# EAGLE schematic Benjamino (EAGLE 6.1)
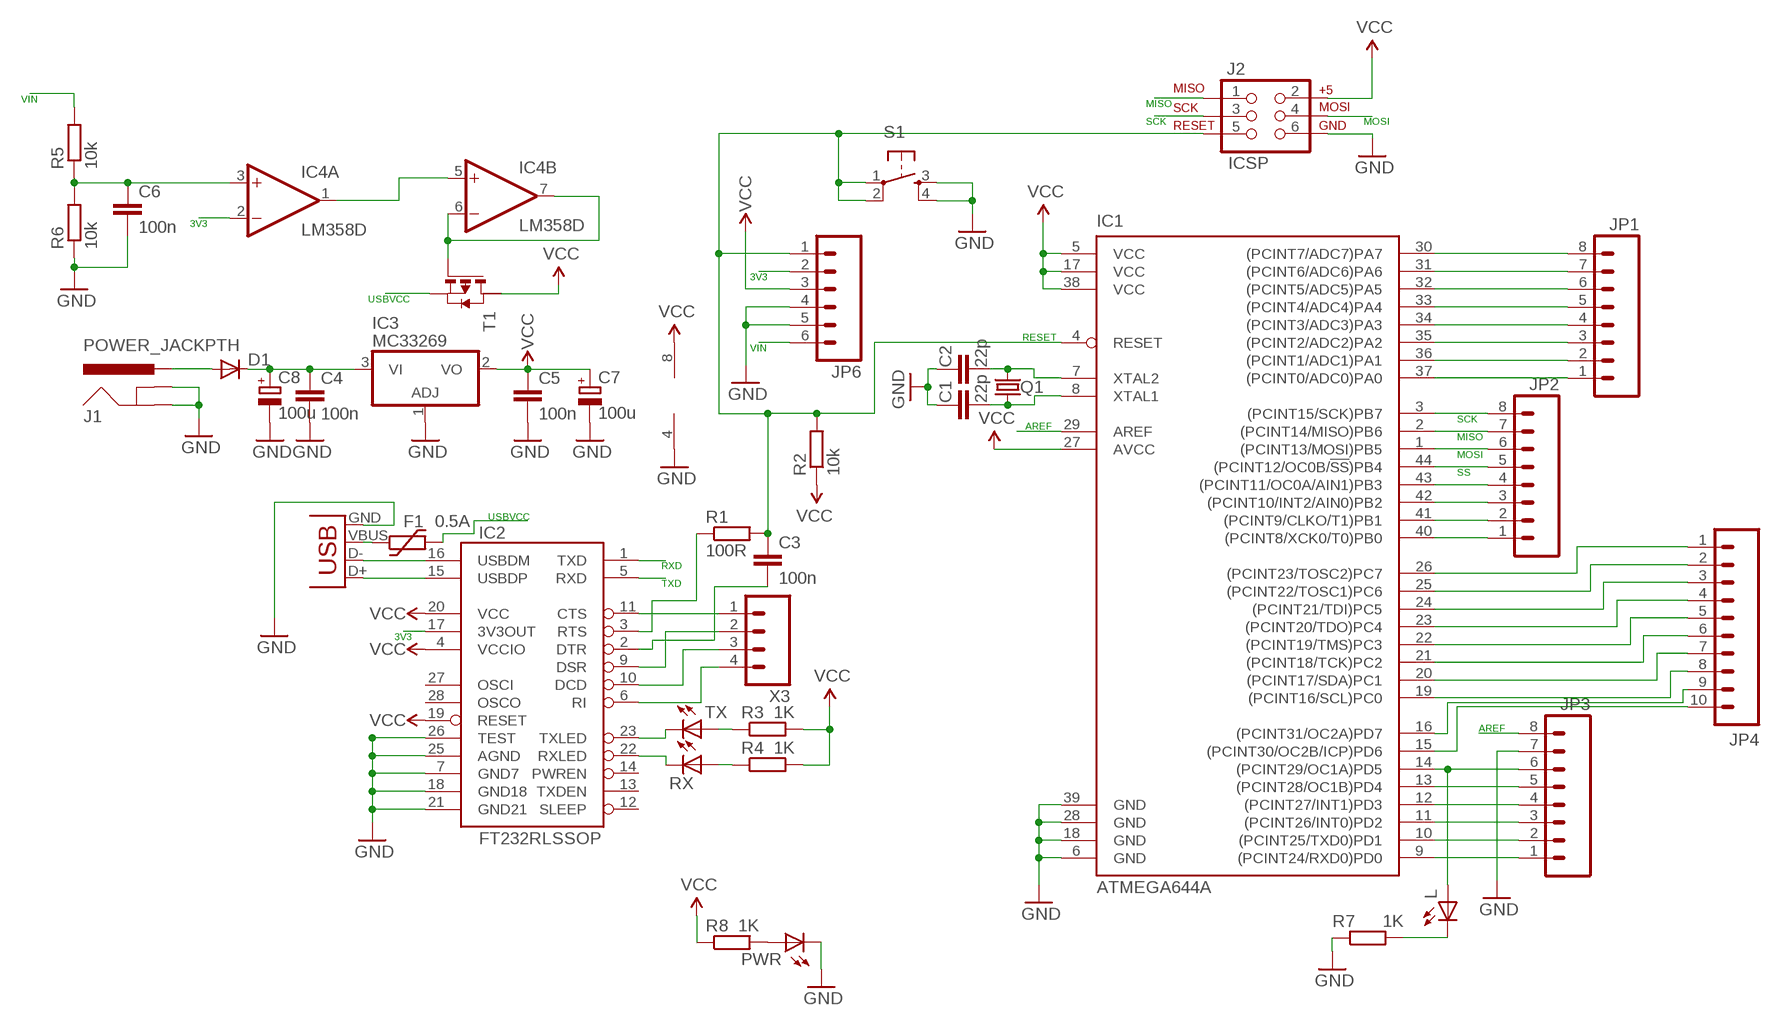
[diagram p0: schematic, sheet 1]

## Parts
C1  22p  C-EUC1206  [C1206]
C2  22p  C-EUC1206  [C1206]
C3  100n  C-EUC1206  [C1206]
C4  100n  C-EUC1206  [C1206]
C5  100n  C-EUC1206  [C1206]
C6  100n  C-EUC1206  [C1206]
C7  100u  CPOL-EUD  [PANASONIC_D]
C8  100u  CPOL-EUD  [PANASONIC_D]
D1  DIODESMA  [SMA-DIODE]
F1  0.5A  1812L  [1812L]
IC1  ATMEGA644A  [TQFP44]
IC2  FT232RLSSOP  [SSOP28DB]
IC3  MC33269  MC33269D-5.0  [DPACK]
IC4  LM358D  [SO08]
J1  POWER_JACKPTH  [POWER_JACK_PTH]
J2  ICSP  AVR_SPI_PRG_6PTH  [2X3]
JP1  M08  [1X08]
JP2  M08  [1X08]
JP3  M08  [1X08]
JP4  M10"  [1X10]
JP6  M06SIP  [1X06]
L  LED1206  [LED-1206]
PWR  LED1206  [LED-1206]
Q1  CRYSTALHC49U-V  [HC49U-V]
R1  100R  R-EU_R1206  [R1206]
R2  10k  R-EU_R1206  [R1206]
R3  1K  R-EU_R1206  [R1206]
R4  1K  R-EU_R1206  [R1206]
R5  10k  R-EU_R1206  [R1206]
R6  10k  R-EU_R1206  [R1206]
R7  1K  R-EU_R1206  [R1206]
R8  1K  R-EU_R1206  [R1206]
RX  LED1206  [LED-1206]
S1  TAC_SWITCHPTH  [TACTILE-PTH]
T1  PMOSSOT223  [SOT223]
TX  LED1206  [LED-1206]
X1  USBSMD  [USB-MINIB]
X3  M04PTH  [1X04]

## Nets
3V3: IC2.17(3V3OUT) IC4.2(A:-IN) JP6.2
AREF: IC1.29(AREF) JP3.8
GND: C1.1 C2.1 C4.2 C5.2 C6.2 C7.- C8.- IC1.6(GND) IC1.18(GND) IC1.28(GND) IC1.39(GND) IC2.7(GND7) IC2.18(GND18) IC2.21(GND21) IC2.25(AGND) IC2.26(TEST) IC3.1(ADJ) IC4.4(P:V-) J1.GND J1.GNDBREAK J2.6 JP3.7 JP6.4 JP6.5 PWR.C R6.1 R7.1 S1.3 S1.4 X1.GND
MISO: IC1.2((PCINT14/MISO)PB6) J2.1 JP2.7
MOSI: IC1.1((PCINT13/MOSI)PB5) J2.4 JP2.6
N$1: IC1.37((PCINT0/ADC0)PA0) JP1.1
N$2: IC1.36((PCINT1/ADC1)PA1) JP1.2
N$3: IC1.35((PCINT2/ADC2)PA2) JP1.3
N$4: IC1.34((PCINT3/ADC3)PA3) JP1.4
N$5: IC1.33((PCINT4/ADC4)PA4) JP1.5
N$6: IC1.32((PCINT5/ADC5)PA5) JP1.6
N$7: C1.2 IC1.8(XTAL1) Q1.1
N$8: C2.2 IC1.7(XTAL2) Q1.2
N$9: IC1.31((PCINT6/ADC6)PA6) JP1.7
N$10: IC1.30((PCINT7/ADC7)PA7) JP1.8
N$11: IC2.15(USBDP) X1.D+
N$12: IC2.16(USBDM) X1.D-
N$13: IC1.26((PCINT23/TOSC2)PC7) JP4.1
N$14: IC1.25((PCINT22/TOSC1)PC6) JP4.2
N$15: IC1.24((PCINT21/TDI)PC5) JP4.3
N$16: IC1.23((PCINT20/TDO)PC4) JP4.4
N$18: D1.A J1.PWR
N$19: IC1.11((PCINT26/INT0)PD2) JP3.3
N$20: IC1.12((PCINT27/INT1)PD3) JP3.4
N$21: IC1.13((PCINT28/OC1B)PD4) JP3.5
N$22: IC1.14((PCINT29/OC1A)PD5) JP3.6 L.A
N$23: IC1.22((PCINT19/TMS)PC3) JP4.5
N$24: IC1.21((PCINT18/TCK)PC2) JP4.6
N$25: IC1.20((PCINT17/SDA)PC1) JP4.7
N$26: IC1.19((PCINT16/SCL)PC0) JP4.8
N$27: IC1.16((PCINT31/OC2A)PD7) JP4.9
N$28: IC1.15((PCINT30/OC2B/ICP)PD6) JP4.10
N$29: IC1.40((PCINT8/XCK0/T0)PB0) JP2.1
N$30: IC1.41((PCINT9/CLKO/T1)PB1) JP2.2
N$31: IC1.42((PCINT10/INT2/AIN0)PB2) JP2.3
N$32: IC1.43((PCINT11/OC0A/AIN1)PB3) JP2.4
N$33: IC2.11(CTS) X3.1
N$34: IC2.9(DSR) X3.2
N$35: IC2.10(DCD) X3.3
N$36: IC2.6(RI) X3.4
N$37: IC2.3(RTS) R1.1
N$38: C3.2 IC2.2(DTR)
N$39: IC2.22(RXLED) RX.C
N$40: IC2.23(TXLED) TX.C
N$41: R3.1 TX.A
N$42: R4.1 RX.A
N$43: F1.P$1 X1.VBUS
N$45: C6.1 IC4.3(A:+IN) R5.1 R6.2
N$46: IC4.1(A:OUT) IC4.5(B:+IN)
N$47: IC4.6(B:-IN) IC4.7(B:OUT) T1.1(G)
N$51: L.C R7.2
N$52: PWR.A R8.2
RESET: C3.1 IC1.4(RESET) J2.5 JP6.1 R1.2 R2.2 S1.1 S1.2
RXD: IC1.9((PCINT24/RXD0)PD0) IC2.1(TXD) JP3.1
SCK: IC1.3((PCINT15/SCK)PB7) J2.3 JP2.8
SS: IC1.44((PCINT12/OC0B/!SS!)PB4) JP2.5
TXD: IC1.10((PCINT25/TXD0)PD1) IC2.5(RXD) JP3.2
USBVCC: F1.P$2 T1.3(S)
VCC: C5.1 C7.+ IC1.5(VCC) IC1.17(VCC) IC1.27(AVCC) IC1.38(VCC) IC2.4(VCCIO) IC2.19(RESET) IC2.20(VCC) IC3.2(VO) IC4.8(P:V+) J2.2 JP6.3 R2.1 R3.2 R4.2 R8.1 T1.2(D)
VIN: C4.1 C8.+ D1.C IC3.3(VI) JP6.6 R5.2
Unconnected: IC2.12(SLEEP) IC2.13(TXDEN) IC2.14(PWREN) IC2.27(OSCI) IC2.28(OSCO) T1.4(D2)

## Notes on the sheet
- VIN
- MISO
- SCK | MOSI
- 3V3
- 3V3
- USBVCC
- RESET
- VIN
- AREF | SCK
- MISO
- MOSI
- SS
- USBVCC
- RXD
- TXD
- 3V3
- AREF

## Library data of the parts
C1-C6 = rcl:C-EU: CAPACITOR, European symbol
C7 C8 = rcl:CPOL-EU: POLARIZED CAPACITOR, European symbol
D1 = SparkFun:DIODE: Diode These are standard reverse protection diodes and small signal diodes. SMA package can handle up to about 1A. SOD-323 can handle about 200mA. What the SOD-323 package when ordering, there are some mfgs out there that are 5-pin packages.
F1 = ptc-littlefuse:1812L
IC1 = atmel:ATMEGA644: 8-bit Microcontroller with 64K Bytes In-System Programmable Flash Source: http://www.atmel.com/dyn/resources/prod_documents/doc2593.pdf; MPN: ATMEGA644PV-10AU; OC_FARNELL: 1455123; OC_NEWARK: 58M3748
IC2 = SparkFun:FT232RL: USB UART FT232RL 4th Generation USB UART (USB <-> Serial) Controller. Spark Fun Electronics SKU : COM-00650
IC3 = linear:MC33269?*: Adjustable Output Low Dropout Voltage Regulator 800 mA Source: http://www.onsemi.com/pub/Collateral/MC33269-D.PDF
IC4 = linear:LM358: OP AMP also LM158; LM258; LM2904 Source: http://cache.national.com/ds/LM/LM158.pdf
J1 = SparkFun:POWER_JACK: Power Jack This is the standard 5.5mm barrel jack for power. The PTH is the most common, proven, reliable, footprint. All others are experimental. The Slot footprint only works if the mill layer is transmitted to the PCB fab house so be warned. Spark Fun Electronics SKU : PRT-00119. Mating wall wart : TOL-00298 (and others)
J2 = SparkFun:AVR_SPI_PRG_6: AVR ISP 6 Pin This is the reduced ISP connector for AVR programming. Common on Arduino. This footprint will take up less PCB space and can be used with a 10-pin to 6-pin adapter such as SKU: BOB-08508
JP1-JP3 = SparkFun:M08: Header 8 Standard 8-pin 0.1" header. Use with straight break away headers (SKU : PRT-00116), right angle break away headers (PRT-00553), swiss pins (PRT-00743), machine pins (PRT-00117), and female headers (PRT-00115).
JP4 = SparkFun:M10: Header 10 Standard 10-pin 0.1" header. Use with straight break away headers (SKU : PRT-00116), right angle break away headers (PRT-00553), swiss pins (PRT-00743), machine pins (PRT-00117), and female headers (PRT-00115).
JP6 = SparkFun:M06: Header 6 Standard 6-pin 0.1" header. Use with straight break away headers (SKU : PRT-00116), right angle break away headers (PRT-00553), swiss pins (PRT-00743), machine pins (PRT-00117), and female headers (PRT-00115). Molex polarized connector foot print use with SKU : PRT-08094 with associated crimp pins and housings. NOTES ON THE VARIANTS LOCK and LOCK_LONGPADS... This footprint was designed to help hold the alignment of a through-hole component (i.e. 6-pin header) while soldering it into place. You may notice that each hole has been shifted either up or down by 0.005 of an inch from it's more standard position (which is a perfectly straight line). This slight alteration caused the pins (the squares in the middle) to touch the edges of the holes. Because they are alternating, it causes a "brace" to hold the component in place. 0.005 has proven to be the perfect amount of "off-center" position when using our standard breakaway headers. Although looks a little odd when you look at the bare footprint, once you have a header in there, the alteration is very hard to notice. Also, if you push a header all the way into place, it is covered up entirely on the bottom side. This idea of altering the position of holes to aid alignment will be further integrated into the Sparkfun Library for other footprints. It can help hold any component with 3 or more connection pins.
L PWR RX TX = SparkFun:LED: LEDs Standard schematic elements and footprints for 5mm, 3mm, 1206, and 0603 sized LEDs. 5mm - Spark Fun Electronics SKU : COM-00529 (and others)
Q1 = crystal:CRYSTAL: CRYSTAL; OC_FARNELL: 1666969; OC_NEWARK: unknown
R1 R3 R4 R7 R8 = resistor:R-EU_: RESISTOR, European symbol
R2 R5 R6 = rcl:R-EU_: RESISTOR, European symbol
S1 = SparkFun:TAC_SWITCH: Momentary Switch Button commonly used for reset or general input. Spark Fun Electronics SKU : COM-00097
T1 = zetex:PMOSSOT223: MOS FET
X1 = SparkFun:USB: USB Connectors USB-B-PTH is fully proven SKU : PRT-00139 USB-miniB is fully proven SKU : PRT-00587 USB-A-PCB is untested. USB-A-H is throughly reviewed, but untested. Spark Fun Electronics SKU : PRT-00437 USB-B-SMT is throughly reviewed, but untested. Needs silkscreen touching up. USB-A-S has not been used/tested USB-MB-H has not been used/tested
X3 = SparkFun:M04: Header 4 Standard 4-pin 0.1" header. Use with straight break away headers (SKU : PRT-00116), right angle break away headers (PRT-00553), swiss pins (PRT-00743), machine pins (PRT-00117), and female headers (PRT-00115). Molex polarized connector foot print use with SKU : PRT-08231 with associated crimp pins and housings.